# EAGLE schematic ADA_1_1 (EAGLE 8.3.2)
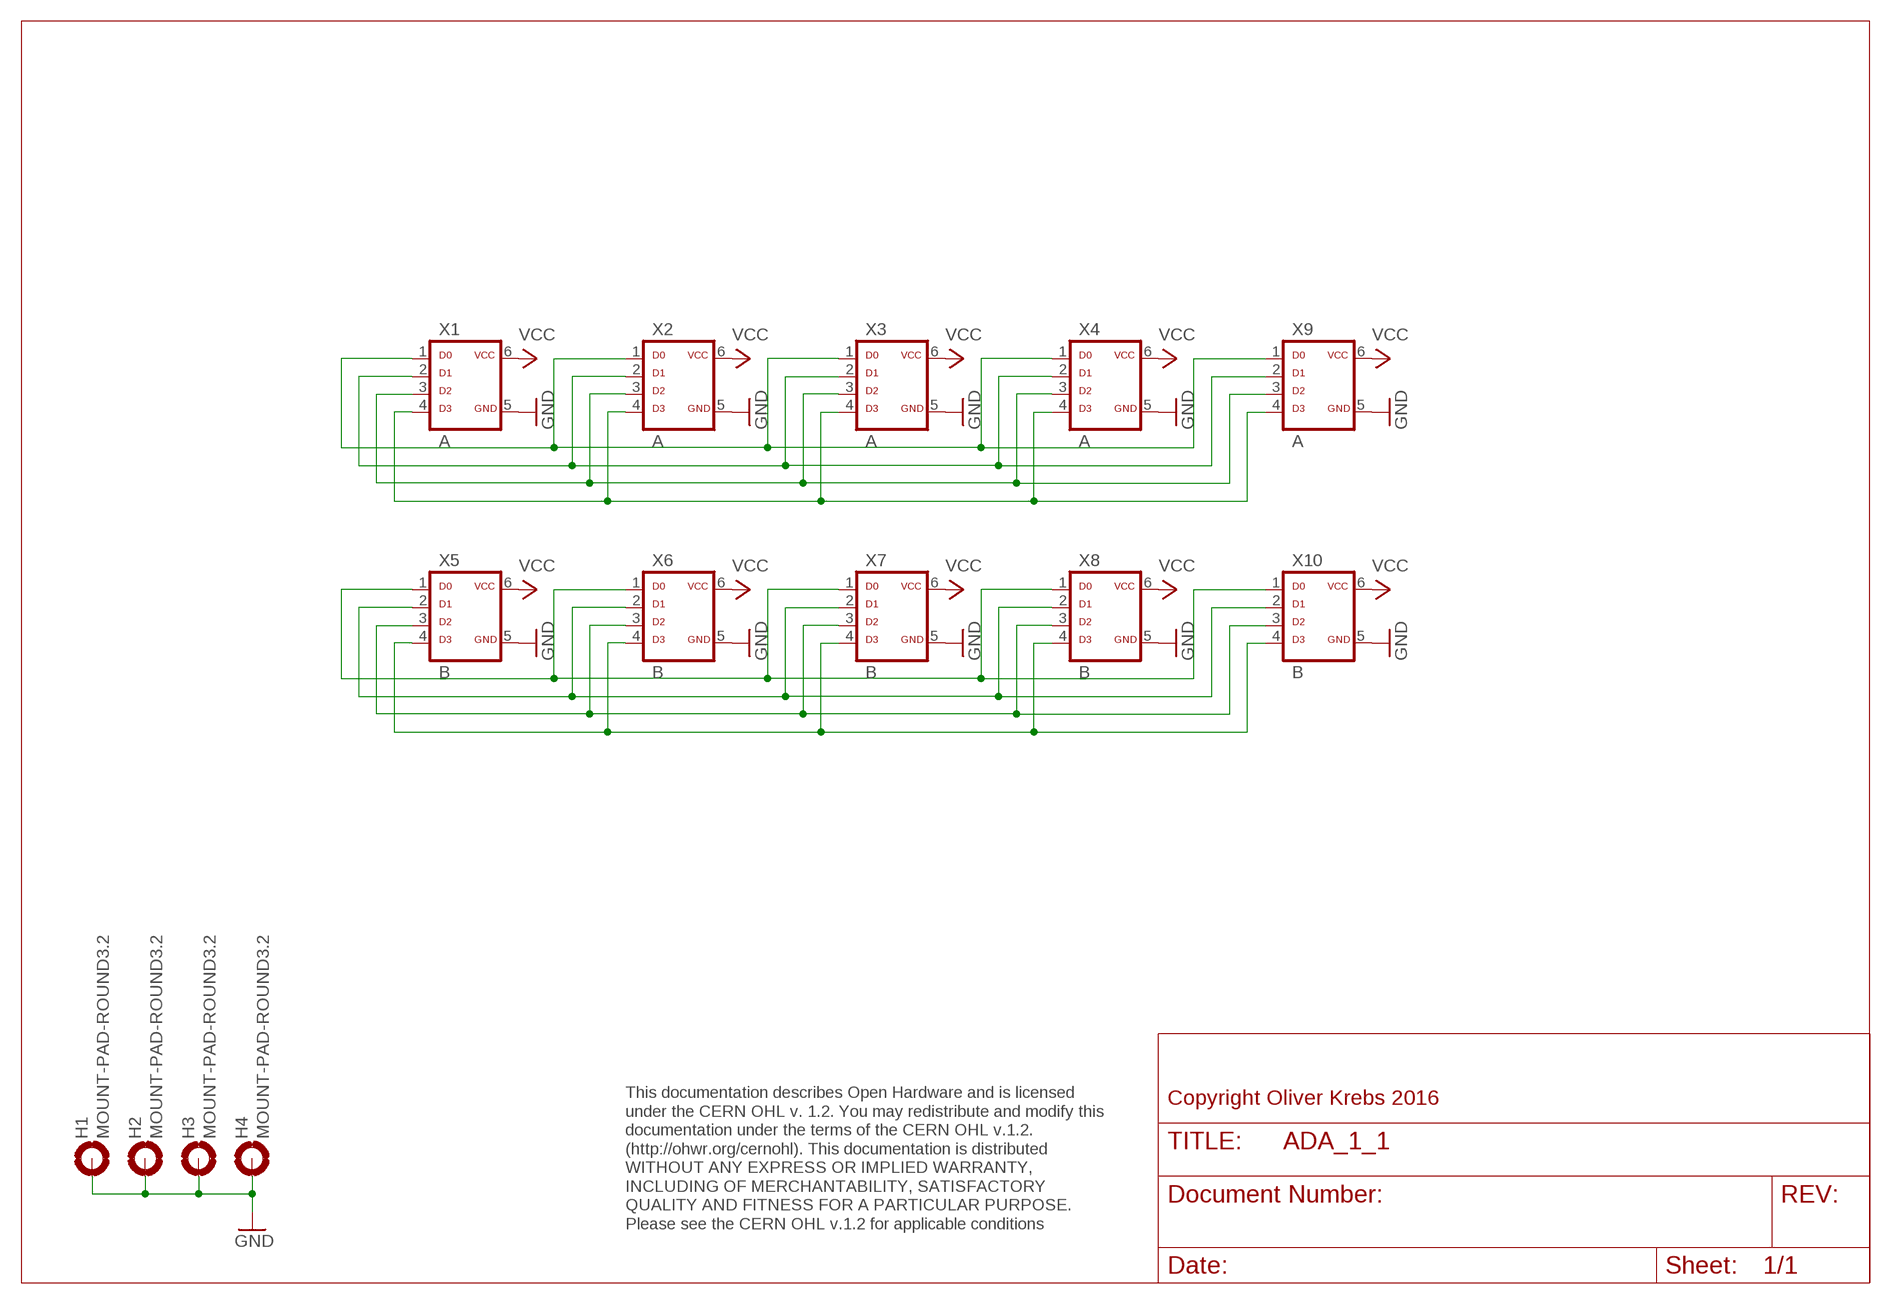
[diagram p0: schematic, sheet 1]

## Parts
H1  MOUNT-PAD-ROUND3.2  [3,2-PAD]
H2  MOUNT-PAD-ROUND3.2  [3,2-PAD]
H3  MOUNT-PAD-ROUND3.2  [3,2-PAD]
H4  MOUNT-PAD-ROUND3.2  [3,2-PAD]
X1  A  ML6D  [ML-6]
X2  A  ML6D  [ML-6]
X3  A  ML6D  [ML-6]
X4  A  ML6D  [ML-6]
X5  B  ML6D  [ML-6]
X6  B  ML6D  [ML-6]
X7  B  ML6D  [ML-6]
X8  B  ML6D  [ML-6]
X9  A  ML6D  [ML-6]
X10  B  ML6D  [ML-6]

## Nets
GND: H1.B3,2(MOUNT) H2.B3,2(MOUNT) H3.B3,2(MOUNT) H4.B3,2(MOUNT) X1.5 X2.5 X3.5 X4.5 X5.5 X6.5 X7.5 X8.5 X9.5 X10.5
N$1: X1.1 X2.1 X3.1 X4.1 X9.1
N$4: X1.2 X2.2 X3.2 X4.2 X9.2
N$7: X1.3 X2.3 X3.3 X4.3 X9.3
N$8: X1.4 X2.4 X3.4 X4.4 X9.4
N$11: X5.1 X6.1 X7.1 X8.1 X10.1
N$12: X5.2 X6.2 X7.2 X8.2 X10.2
N$13: X5.3 X6.3 X7.3 X8.3 X10.3
N$14: X5.4 X6.4 X7.4 X8.4 X10.4
VCC: X1.6 X2.6 X3.6 X4.6 X5.6 X6.6 X7.6 X8.6 X9.6 X10.6

## Notes on the sheet
- Copyright Oliver Krebs 2016
- This documentation describes Open Hardware and is licensed 
  under the CERN OHL v. 1.2. You may redistribute and modify this 
  documentation under the terms of the CERN OHL v.1.2. 
  (http://ohwr.org/cernohl). This documentation is distributed
  WITHOUT ANY EXPRESS OR IMPLIED WARRANTY, 
  INCLUDING OF MERCHANTABILITY, SATISFACTORY 
  QUALITY AND FITNESS FOR A PARTICULAR PURPOSE. 
  Please see the CERN OHL v.1.2 for applicable conditions

## Library data of the parts
H1-H4 = holes:MOUNT-PAD-ROUND: MOUNTING PAD, round
X1-X10 = 01-my-con:ML6D